# EAGLE schematic PCB-2.0_v16 (EAGLE 9.7.0)
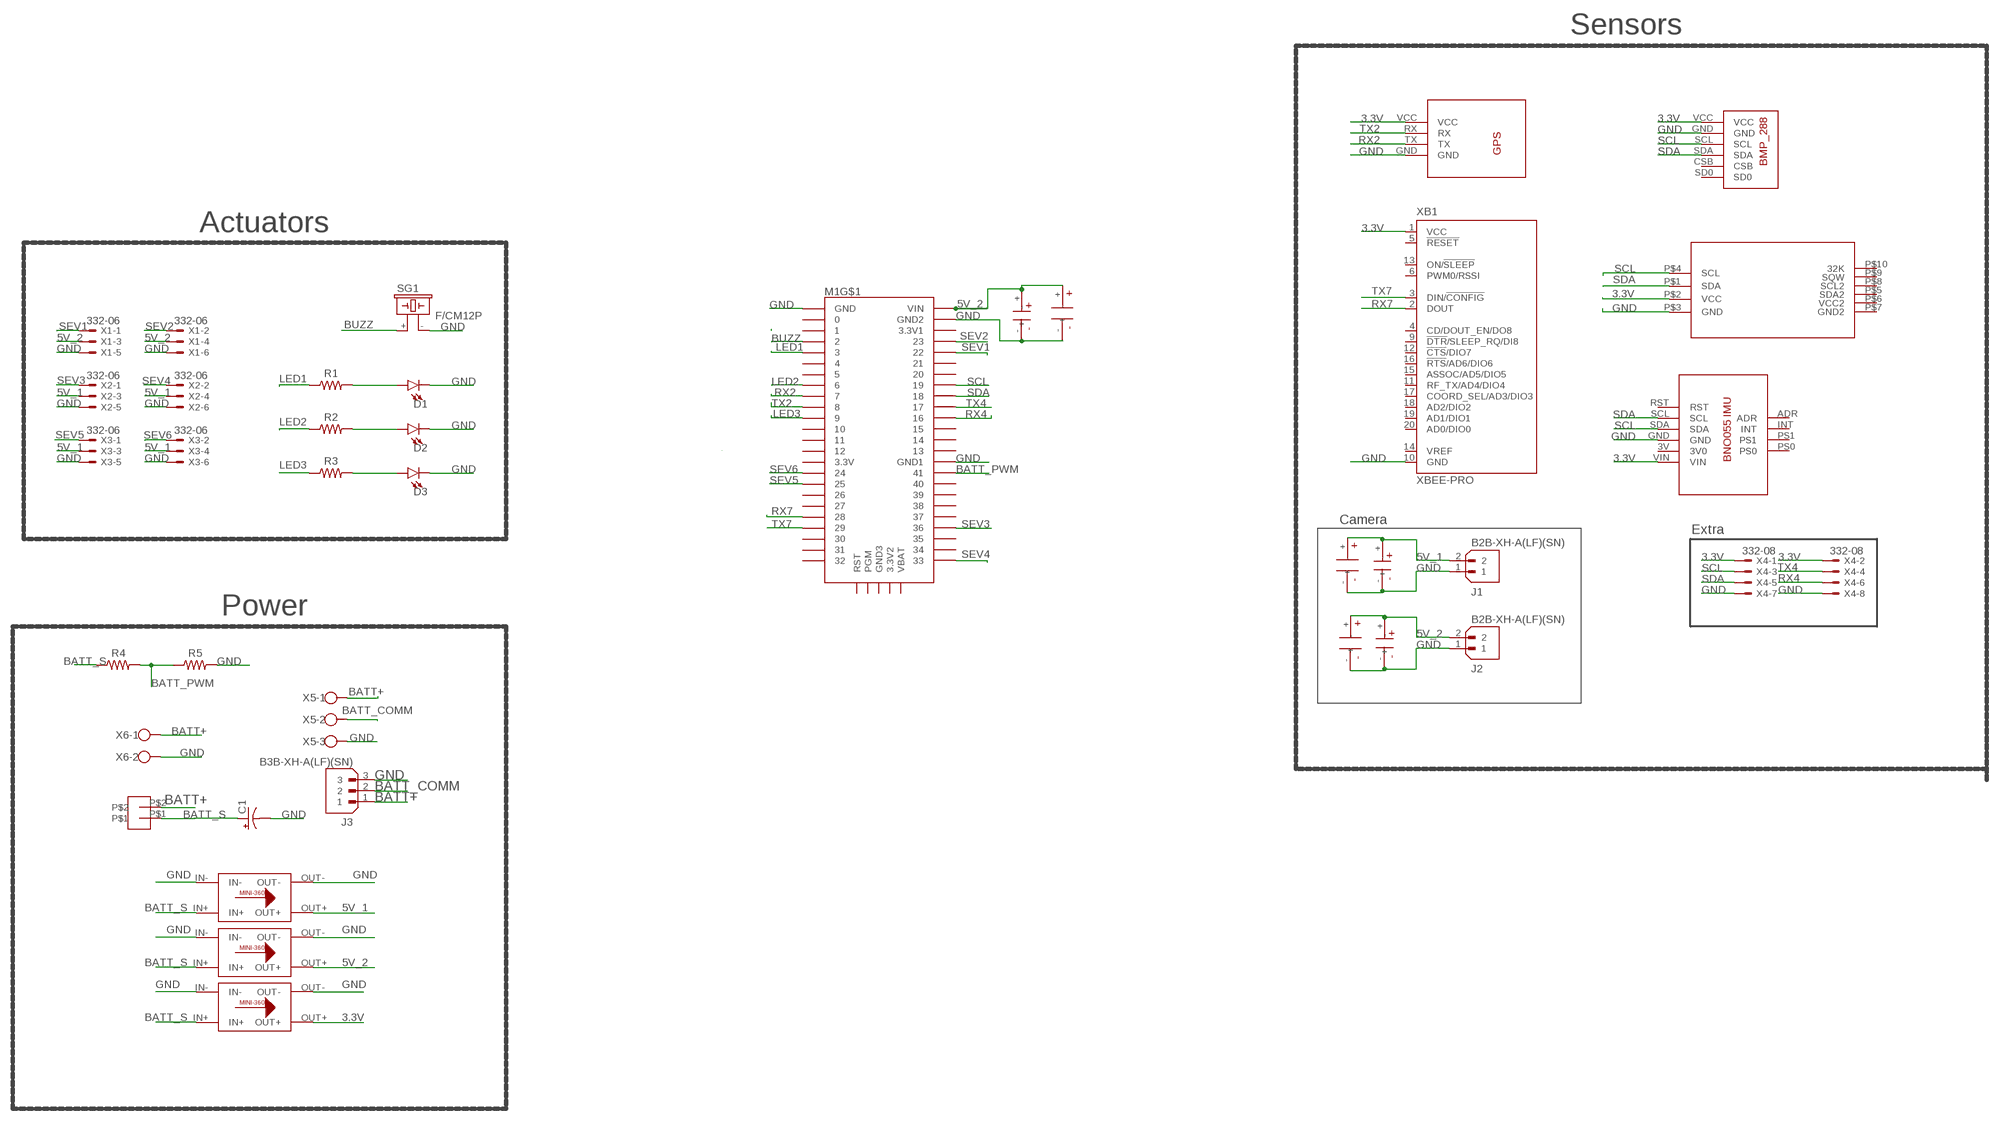
[diagram p0: schematic, sheet 1]

## Parts
C1  1000UF-RADIAL-5MM-25V-20%-NO-SILK  [CPOL-RADIAL-5MM-10MM-NS]
D1  LED3MM  [LED_3MM]
D2  LED3MM  [LED_3MM]
D3  LED3MM  [LED_3MM]
J1  B2B-XH-A(LF)(SN)  [JST_B2B-XH-A(LF)(SN)]
J2  B2B-XH-A(LF)(SN)  [JST_B2B-XH-A(LF)(SN)]
J3  B3B-XH-A(LF)(SN)  [JST_B3B-XH-A(LF)(SN)]
M1  TEENSY4.1  [TEENSY4.1]
R1  R-US_AXIAL-7.2MM-PITCH  [RESAD724W46L381D178B]
R2  R-US_AXIAL-7.2MM-PITCH  [RESAD724W46L381D178B]
R3  R-US_AXIAL-7.2MM-PITCH  [RESAD724W46L381D178B]
R4  R-US_AXIAL-7.2MM-PITCH  [RESAD724W46L381D178B]
R5  R-US_AXIAL-7.2MM-PITCH  [RESAD724W46L381D178B]
SG1  F/CM12P  [F/CM12P]
U$1  BMP_280THTOUGHHOLE  [BNO055_SELF]
U$2  GPS  [GPS]
U$3  VARY_BUCK  [VARY_BUCK]
U$4  BNO055  [BNO055]
U$5  VARY_BUCK  [VARY_BUCK]
U$6  VARY_BUCK  [VARY_BUCK]
U$7  DS3231_RTC  [DS3231_RTC]
U$9  2_PIN  [2_PIN]
U$10  100UF-ELECTROLYTIC  [100UF_ELECTROLYTIC]
U$11  100UF-ELECTROLYTIC  [100UF_ELECTROLYTIC]
U$12  100UF-ELECTROLYTIC  [100UF_ELECTROLYTIC]
U$16  0.1UF_CERAMIC  [0.1UF_CERAMIC]
U$17  0.1UF_CERAMIC  [0.1UF_CERAMIC]
U$18  0.1UF_CERAMIC  [0.1UF_CERAMIC]
X1  332-06  [332-06]
X2  332-06  [332-06]
X3  332-06  [332-06]
X4  332-08  [332-08]
X5  W237-103  [W237-103]
X6  W237-102  [W237-102]
XB1  XBEE-PRO  [XBEE-PRO]

## Nets
3.3V: U$1.VCC U$2.VCC U$3.OUT+ U$4.VIN U$7.P$2(VCC) X4.1 X4.2 XB1.1(VCC)
5V_1: J1.2 U$5.OUT+ U$10.+ U$16.+ X2.3 X2.4 X3.3 X3.4
5V_2: J2.2 M1.VIN U$6.OUT+ U$11.+ U$12.+ U$17.+ U$18.+ X1.3 X1.4
BATT+: J3.1 U$9.P$2 X5.1 X6.1
BATT_COMM: J3.2 X5.2
BATT_PWM: M1.41 R4.2 R5.1
BATT_S: C1.+ R4.1 U$3.IN+ U$5.IN+ U$6.IN+ U$9.P$1
BUZZ: M1.2 SG1.+
GND: C1.- D1.K(C) D2.K(C) D3.K(C) J1.1 J2.1 J3.3 M1.AGND(GND2) M1.GND M1.GND1 R5.2 SG1.- U$1.GND U$2.GND U$3.IN- U$3.OUT- U$4.GND U$5.IN- U$5.OUT- U$6.IN- U$6.OUT- U$7.P$3(GND) U$10.- U$11.- U$12.- U$16.- U$17.- U$18.- X1.5 X1.6 X2.5 X2.6 X3.5 X3.6 X4.7 X4.8 X5.3 X6.2 XB1.10(GND)
LED1: M1.3 R1.1
LED2: M1.6 R2.1
LED3: M1.9 R3.1
N$1: D1.A R1.2
N$2: D2.A R2.2
N$3: D3.A R3.2
RX2: M1.7 U$2.TX
RX4: M1.16/A2 X4.6
RX7: M1.28 XB1.2(DOUT)
SCL: M1.19/A5/SCL U$1.SCL U$4.SDA U$7.P$4(SCL) X4.3
SDA: M1.18/A4/SDA U$1.SDA U$4.SCL U$7.P$1(SDA) X4.5
SEV1: M1.22/A8 X1.1
SEV2: M1.23/A9 X1.2
SEV3: M1.36 X2.1
SEV4: M1.33 X2.2
SEV5: M1.25 X3.1
SEV6: M1.24 X3.2
TX2: M1.8 U$2.RX
TX4: M1.17/A3 X4.4
TX7: M1.29 XB1.3(DIN/!CONFIG)
Unconnected: M1.0/RX M1.1/TX M1.3V3(3.3V) M1.3V3_LO(3.3V1) M1.4 M1.5 M1.10/CS M1.11/MOSI M1.12/MISO M1.13/SCK M1.14/A0 M1.15/A1 M1.20/A6 M1.21/A7 M1.26 M1.27 M1.30 M1.31/A12 M1.32 M1.34 M1.35 M1.37 M1.38 M1.39 M1.40 M1.ELED M1.ER+ M1.ER- M1.ET+(ET-) M1.ET-(ET+) M1.GND2(GND3) M1.GND-E(EGND) M1.GND-U1(UGND1) M1.GND-U2(UGND2) M1.PROG(PGM) M1.RST M1.UD+(UDP) M1.UD-(UDM) M1.UVHST(U5V) M1.V33(3.3V2) M1.VBAT U$1.CSB U$1.SD0 U$4.3V(3V0) U$4.ADR U$4.INT U$4.PS0 U$4.PS1 U$4.RST U$7.P$5(SDA2) U$7.P$6(VCC2) U$7.P$7(GND2) U$7.P$8(SCL2) U$7.P$9(SQW) U$7.P$10(32K) XB1.4(CD/DOUT_EN/DO8) XB1.5(!RESET) XB1.6(PWM0/RSSI) XB1.9(!DTR!/SLEEP_RQ/DI8) XB1.11(RF_TX/AD4/DIO4) XB1.12(!CTS!/DIO7) XB1.13(ON/!SLEEP) XB1.14(VREF) XB1.15(ASSOC/AD5/DIO5) XB1.16(!RTS!/AD6/DIO6) XB1.17(COORD_SEL/AD3/DIO3) XB1.18(AD2/DIO2) XB1.19(AD1/DIO1) XB1.20(AD0/DIO0)

## Notes on the sheet
- Sensors
- Actuators
- Camera
- Extra
- Power

## Library data of the parts
C1 = SparkFun-Capacitors:1000UF: 1,000µF/1mF ceramic capacitors A capacitor is a passive two-terminal electrical component used to store electrical energy temporarily in an electric field. CAP-08070
D1-D3 = SparkFun-LED:LED: LED (Generic) Standard schematic elements and footprints for 5mm, 3mm, 1206, and 0603 sized LEDs. Generic LEDs with no color specified.; PROD_ID: DIO-08794
J1 J2 = 2pin_JST:B2B-XH-A(LF)(SN): Check availability <https://pricing.snapeda.com/parts/B2B-XH-A%28LF%29%28SN%29/JST%20Sales/view-part?ref=eda>; AVAILABILITY: In Stock; CHECK_PRICES: https://www.snapeda.com/parts/B2B-XH-A(LF)(SN)/JST+Sales+America+Inc./view-part/?ref=eda; DESCRIPTION: Connector Header Through Hole 2 position 0.098 (2.50mm); MF: JST Sales; MP: B2B-XH-A(LF)(SN); PACKAGE: None; PRICE: None; SNAPEDA_LINK: https://www.snapeda.com/parts/B2B-XH-A(LF)(SN)/JST+Sales+America+Inc./view-part/?ref=snap
J3 = 3pin_JST:B3B-XH-A(LF)(SN): Check availability <https://pricing.snapeda.com/parts/B3B-XH-A%28LF%29%28SN%29/JST%20Sales/view-part?ref=eda>; AVAILABILITY: In Stock; CHECK_PRICES: https://www.snapeda.com/parts/B3B-XH-A(LF)(SN)/JST+Sales+America+Inc./view-part/?ref=eda; DESCRIPTION: Connector Header Through Hole 3 position 0.098 (2.50mm); MF: JST Sales; MP: B3B-XH-A(LF)(SN); PACKAGE: None; PRICE: None; SNAPEDA_LINK: https://www.snapeda.com/parts/B3B-XH-A(LF)(SN)/JST+Sales+America+Inc./view-part/?ref=snap
M1 = teensy4.1.dist:TEENSY4.1
R1-R5 = Resistor:R-US: Resistor Fixed - ANSI; CATEGORY: Resistor; SUB-CATEGORY: Fixed
SG1 = buzzer_roundHole:F/CM12P: BUZZER Source: Buerklin; OC_FARNELL: unknown; OC_NEWARK: unknown
U$1 = BMP_280:BMP_280
U$2 = GPS:GPS
U$3 U$5 U$6 = Vary_Buck:VARY_BUCK
U$4 = BNO055_NOHOLE:BNO055
U$7 = DS3231_RTC:DS3231_RTC
U$9 = 2x1_pin:2_PIN
U$10-U$12 = 100uF_electrolytic:100UF-ELECTROLYTIC
U$16-U$18 = Library:0.1UF_CERAMIC
X1-X3 = 6pinConnector:332-06: 6 Pin - 2mm Dual Row Source: www.mpe-connector.de / garry_shortform_2012.pdf
X4 = 6pinConnector:332-08: 8 Pin - 2mm Dual Row Source: www.mpe-connector.de / garry_shortform_2012.pdf
X5 = con-wago-500:W237-103: WAGO SCREW CLAMP; MPN: 237-103; OC_FARNELL: unknown; OC_NEWARK: 18M7116
X6 = con-wago-500:W237-102: WAGO SCREW CLAMP; MPN: 237-102; OC_FARNELL: unknown; OC_NEWARK: 70K9898
XB1 = xbee:XBEE: XBee (TM) /XBee-PRO(TM) OEM RF Modules Source: MaxStream, Inc. xbee_productmanual.pdf; MPN: XBP24-AWI-001; OC_FARNELL: 1337916; OC_NEWARK: 42M2667